# EAGLE schematic vocore-evk (EAGLE 6.6.0)
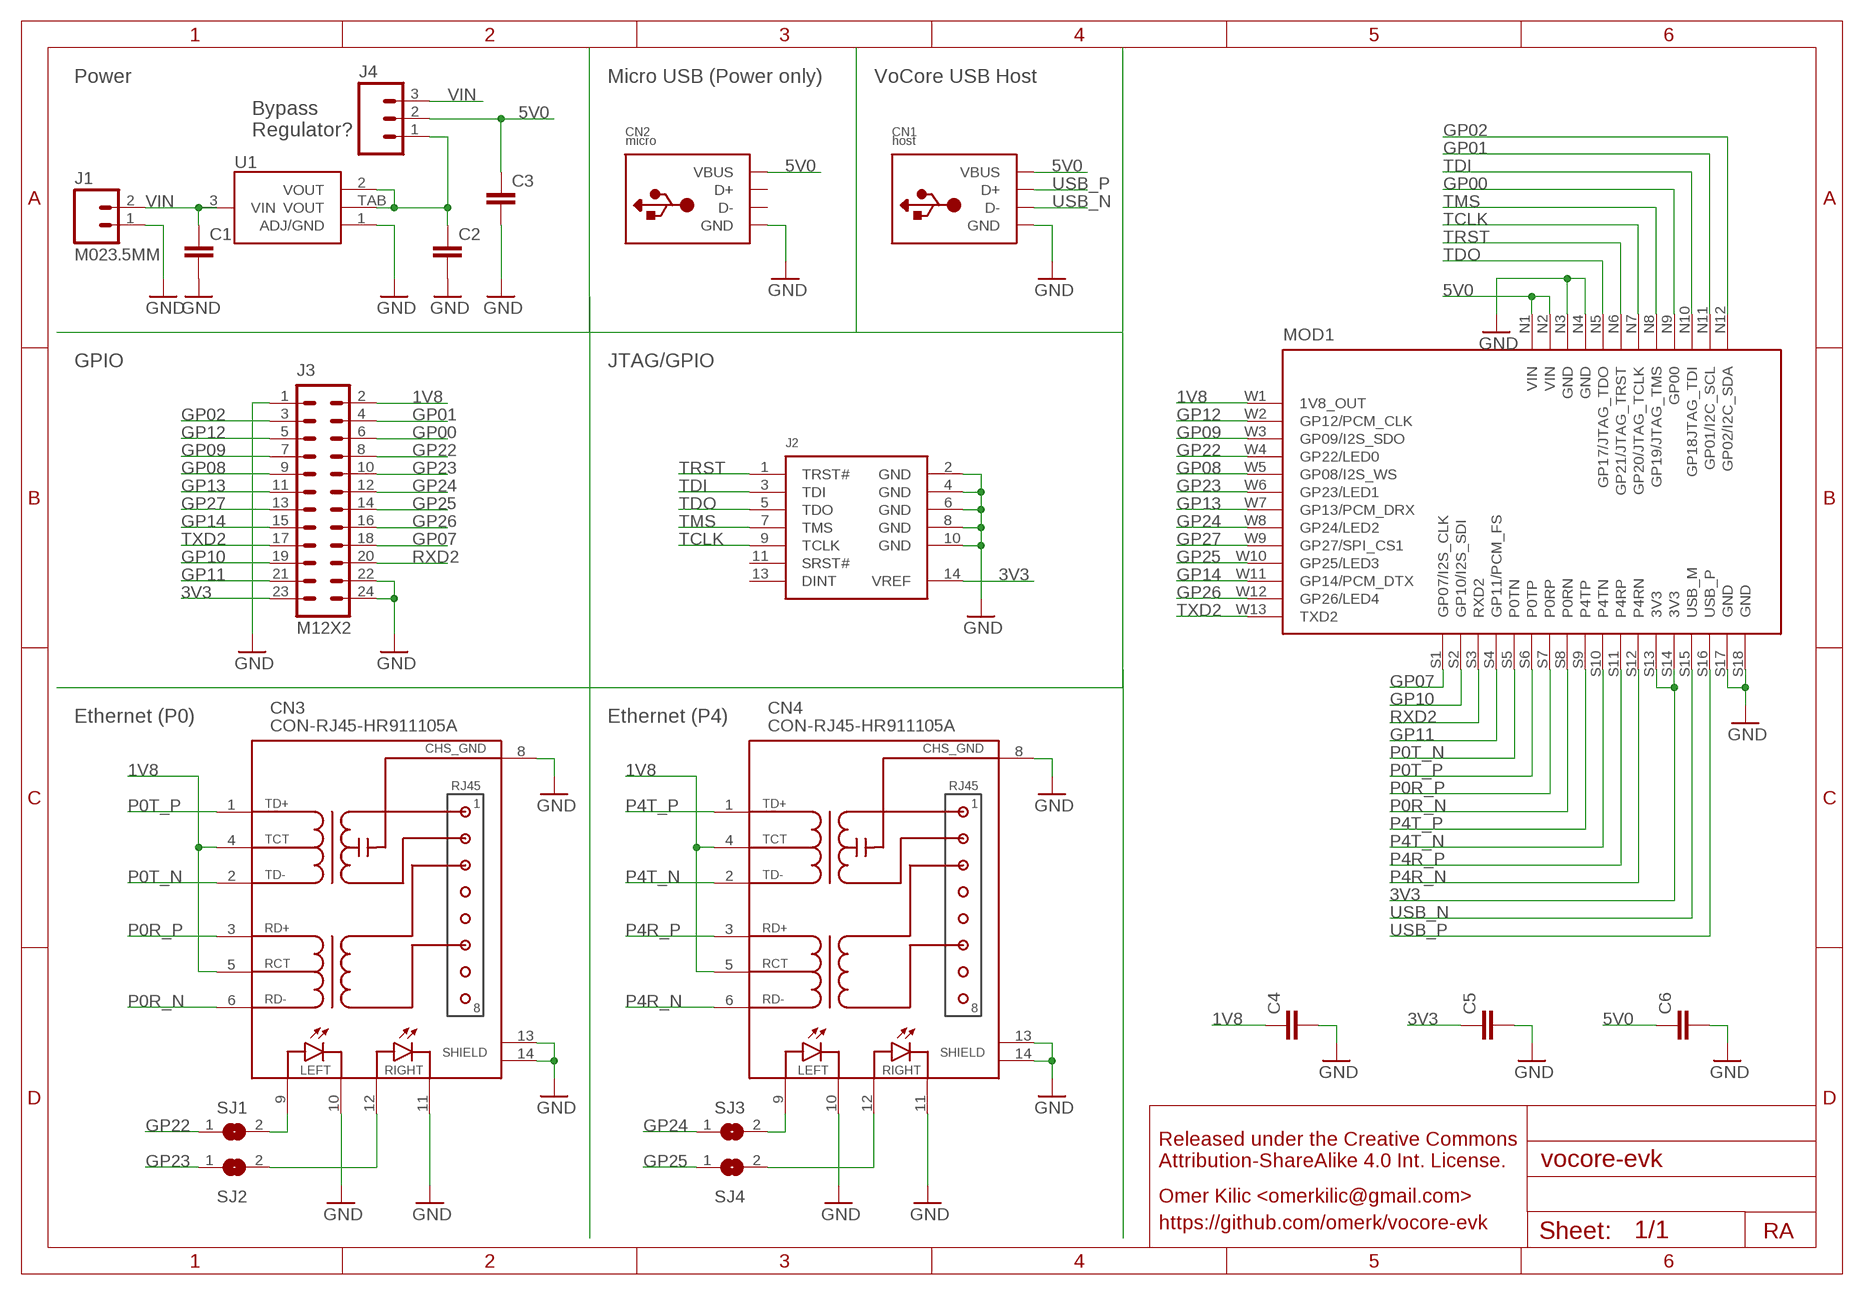
[diagram p0: schematic, sheet 1]

## Parts
C1  C-EUC0805  [C0805]
C2  C-EUC0805  [C0805]
C3  C-EUC0805  [C0805]
C4  C-EUC0805  [C0805]
C5  C-EUC0805  [C0805]
C6  C-EUC0805  [C0805]
CN1  host  CON-USB-A-FEMALE-TH  [USB-A-FEMALE-TH]
CN2  micro  CON-USB-MICRO-FEMALE-SMD  [USB-MOLEX-47346-0001]
CN3  CON-RJ45-HR911105A  [HR911105A]
CN4  CON-RJ45-HR911105A  [HR911105A]
J1  M023.5MM  [SCREWTERMINAL-3.5MM-2]
J2  EJTAG_MIPS  [M2X7]
J3  M12X2  [M2X12]
J4  M03PTH  [1X03]
MOD1  VOCORE_V10A  [VOCORE_V10A]
SJ1  SJ  [SJ]
SJ2  SJ  [SJ]
SJ3  SJ  [SJ]
SJ4  SJ  [SJ]
U1  LDO1117-SOT223  [SOT223-3L]

## Nets
1V8: C4.1 CN3.4(TCT) CN3.5(RCT) CN4.4(TCT) CN4.5(RCT) J3.2 MOD1.W1(1V8_OUT)
3V3: C5.1 J2.14(VREF) J3.23 MOD1.S13(3V3) MOD1.S14(3V3)
5V0: C3.1 C6.1 CN1.VBUS CN2.VBUS J4.2 MOD1.N1(VIN) MOD1.N2(VIN)
GND: C1.2 C2.2 C3.2 C4.2 C5.2 C6.2 CN1.GND CN2.GND CN3.8(CHS_GND) CN3.10(LEFT_GRN_LED_K) CN3.11(RIGHT_YLW_LED_K) CN3.13(SHIELD) CN3.14(SHIELD) CN4.8(CHS_GND) CN4.10(LEFT_GRN_LED_K) CN4.11(RIGHT_YLW_LED_K) CN4.13(SHIELD) CN4.14(SHIELD) J1.1 J2.2(GND) J2.4(GND) J2.6(GND) J2.8(GND) J2.10(GND) J3.1 J3.22 J3.24 MOD1.N3(GND) MOD1.N4(GND) MOD1.S17(GND) MOD1.S18(GND) U1.1(ADJ/GND)
GP00: J3.6 MOD1.N9(GP00)
GP01: J3.4 MOD1.N11(GP01/I2C_SCL)
GP02: J3.3 MOD1.N12(GP02/I2C_SDA)
GP07: J3.18 MOD1.S1(GP07/I2S_CLK)
GP08: J3.9 MOD1.W5(GP08/I2S_WS)
GP09: J3.7 MOD1.W3(GP09/I2S_SDO)
GP10: J3.19 MOD1.S2(GP10/I2S_SDI)
GP11: J3.21 MOD1.S4(GP11/PCM_FS)
GP12: J3.5 MOD1.W2(GP12/PCM_CLK)
GP13: J3.11 MOD1.W7(GP13/PCM_DRX)
GP14: J3.15 MOD1.W11(GP14/PCM_DTX)
GP22: J3.8 MOD1.W4(GP22/LED0) SJ1.1
GP23: J3.10 MOD1.W6(GP23/LED1) SJ2.1
GP24: J3.12 MOD1.W8(GP24/LED2) SJ3.1
GP25: J3.14 MOD1.W10(GP25/LED3) SJ4.1
GP26: J3.16 MOD1.W12(GP26/LED4)
GP27: J3.13 MOD1.W9(GP27/SPI_CS1)
LED1: CN3.12(RIGHT_YLW_LED_A) SJ2.2
N$3: CN3.9(LEFT_GRN_LED_A) SJ1.2
N$4: CN4.9(LEFT_GRN_LED_A) SJ3.2
N$5: CN4.12(RIGHT_YLW_LED_A) SJ4.2
P0R_N: CN3.6(RD-) MOD1.S8(P0RN)
P0R_P: CN3.3(RD+) MOD1.S7(P0RP)
P0T_N: CN3.2(TD-) MOD1.S5(P0TN)
P0T_P: CN3.1(TD+) MOD1.S6(P0TP)
P4R_N: CN4.6(RD-) MOD1.S12(P4RN)
P4R_P: CN4.3(RD+) MOD1.S11(P4RP)
P4T_N: CN4.2(TD-) MOD1.S10(P4TN)
P4T_P: CN4.1(TD+) MOD1.S9(P4TP)
RXD2: J3.20 MOD1.S3(RXD2)
TCLK: J2.9(TCLK) MOD1.N7(GP20/JTAG_TCLK)
TDI: J2.3(TDI) MOD1.N10(GP18JTAG_TDI)
TDO: J2.5(TDO) MOD1.N5(GP17/JTAG_TDO)
TMS: J2.7(TMS) MOD1.N8(GP19/JTAG_TMS)
TRST: J2.1(TRST#) MOD1.N6(GP21/JTAG_TRST)
TXD2: J3.17 MOD1.W13(TXD2)
USB_N: CN1.D- MOD1.S15(USB_M)
USB_P: CN1.D+ MOD1.S16(USB_P)
VIN: C1.1 J1.2 J4.3 U1.3(VIN)
VREG: C2.1 J4.1 U1.2(VOUT) U1.TAB(VOUT)
Unconnected: CN2.D+ CN2.D- J2.11(SRST#) J2.13(DINT)

## Notes on the sheet
- Power | Micro USB (Power only) | VoCore USB Host
- Bypass
  Regulator?
- GPIO | JTAG/GPIO
- Ethernet (P0) | Ethernet (P4)
- Released under the Creative Commons 
  Attribution-ShareAlike 4.0 Int. License.
- Omer Kilic <omerkilic@gmail.com>
- https://github.com/omerk/vocore-evk
- RA

## Library data of the parts
C1-C6 = rcl:C-EU: CAPACITOR, European symbol
CN1 CN2 = ok:CON-USB
CN3 CN4 = ok:CON-RJ45-HR911105A
J1 = SparkFun-Connectors:M02: Standard 2-pin 0.1" header. Use with - straight break away headers ( PRT-00116) - right angle break away headers (PRT-00553) - swiss pins (PRT-00743) - machine pins (PRT-00117) - female headers (PRT-00115) Molex polarized connector foot print use with: PRT-08233 with associated crimp pins and housings. 2.54_SCREWTERM for use with PRT-10571. 3.5mm Screw Terminal footprints for PRT-08084 5mm Screw Terminal footprints for use with PRT-08433
J2 = ok:EJTAG_MIPS
J3 = ok:M12X2
J4 = SparkFun-Connectors:M03: Header 3 Standard 3-pin 0.1" header. Use with straight break away headers (SKU : PRT-00116), right angle break away headers (PRT-00553), swiss pins (PRT-00743), machine pins (PRT-00117), and female headers (PRT-00115). Molex polarized connector foot print use with SKU : PRT-08232 with associated crimp pins and housings.
MOD1 = vocore:VOCORE_V10A: VoCore module footprint, revision 1.0a Based on: http://vonger.cn/wp-content/uploads/2014/06/VoCore.v1.0a.pcb_.pdf Found a bug? Get in touch or send a pull request at https://github.com/omerk/vocore-evk
SJ1-SJ4 = jumper:SJ: SMD solder JUMPER
U1 = ok:LDO1117: LDO1117 e.g. http://www.diodes.com/datasheets/ZLDO1117.pdf